# EasyEDA Pro project 多组分NO.2.eprj, schematic Schematic2
Create Date: 2025-03-08; Page Name: P1; Project Name: 多组分NO.2; Schematic Name: Schematic2; Update Date: 2025-04-01; Company: 嘉立创EDA; Page Size: A3; Version: V1.0
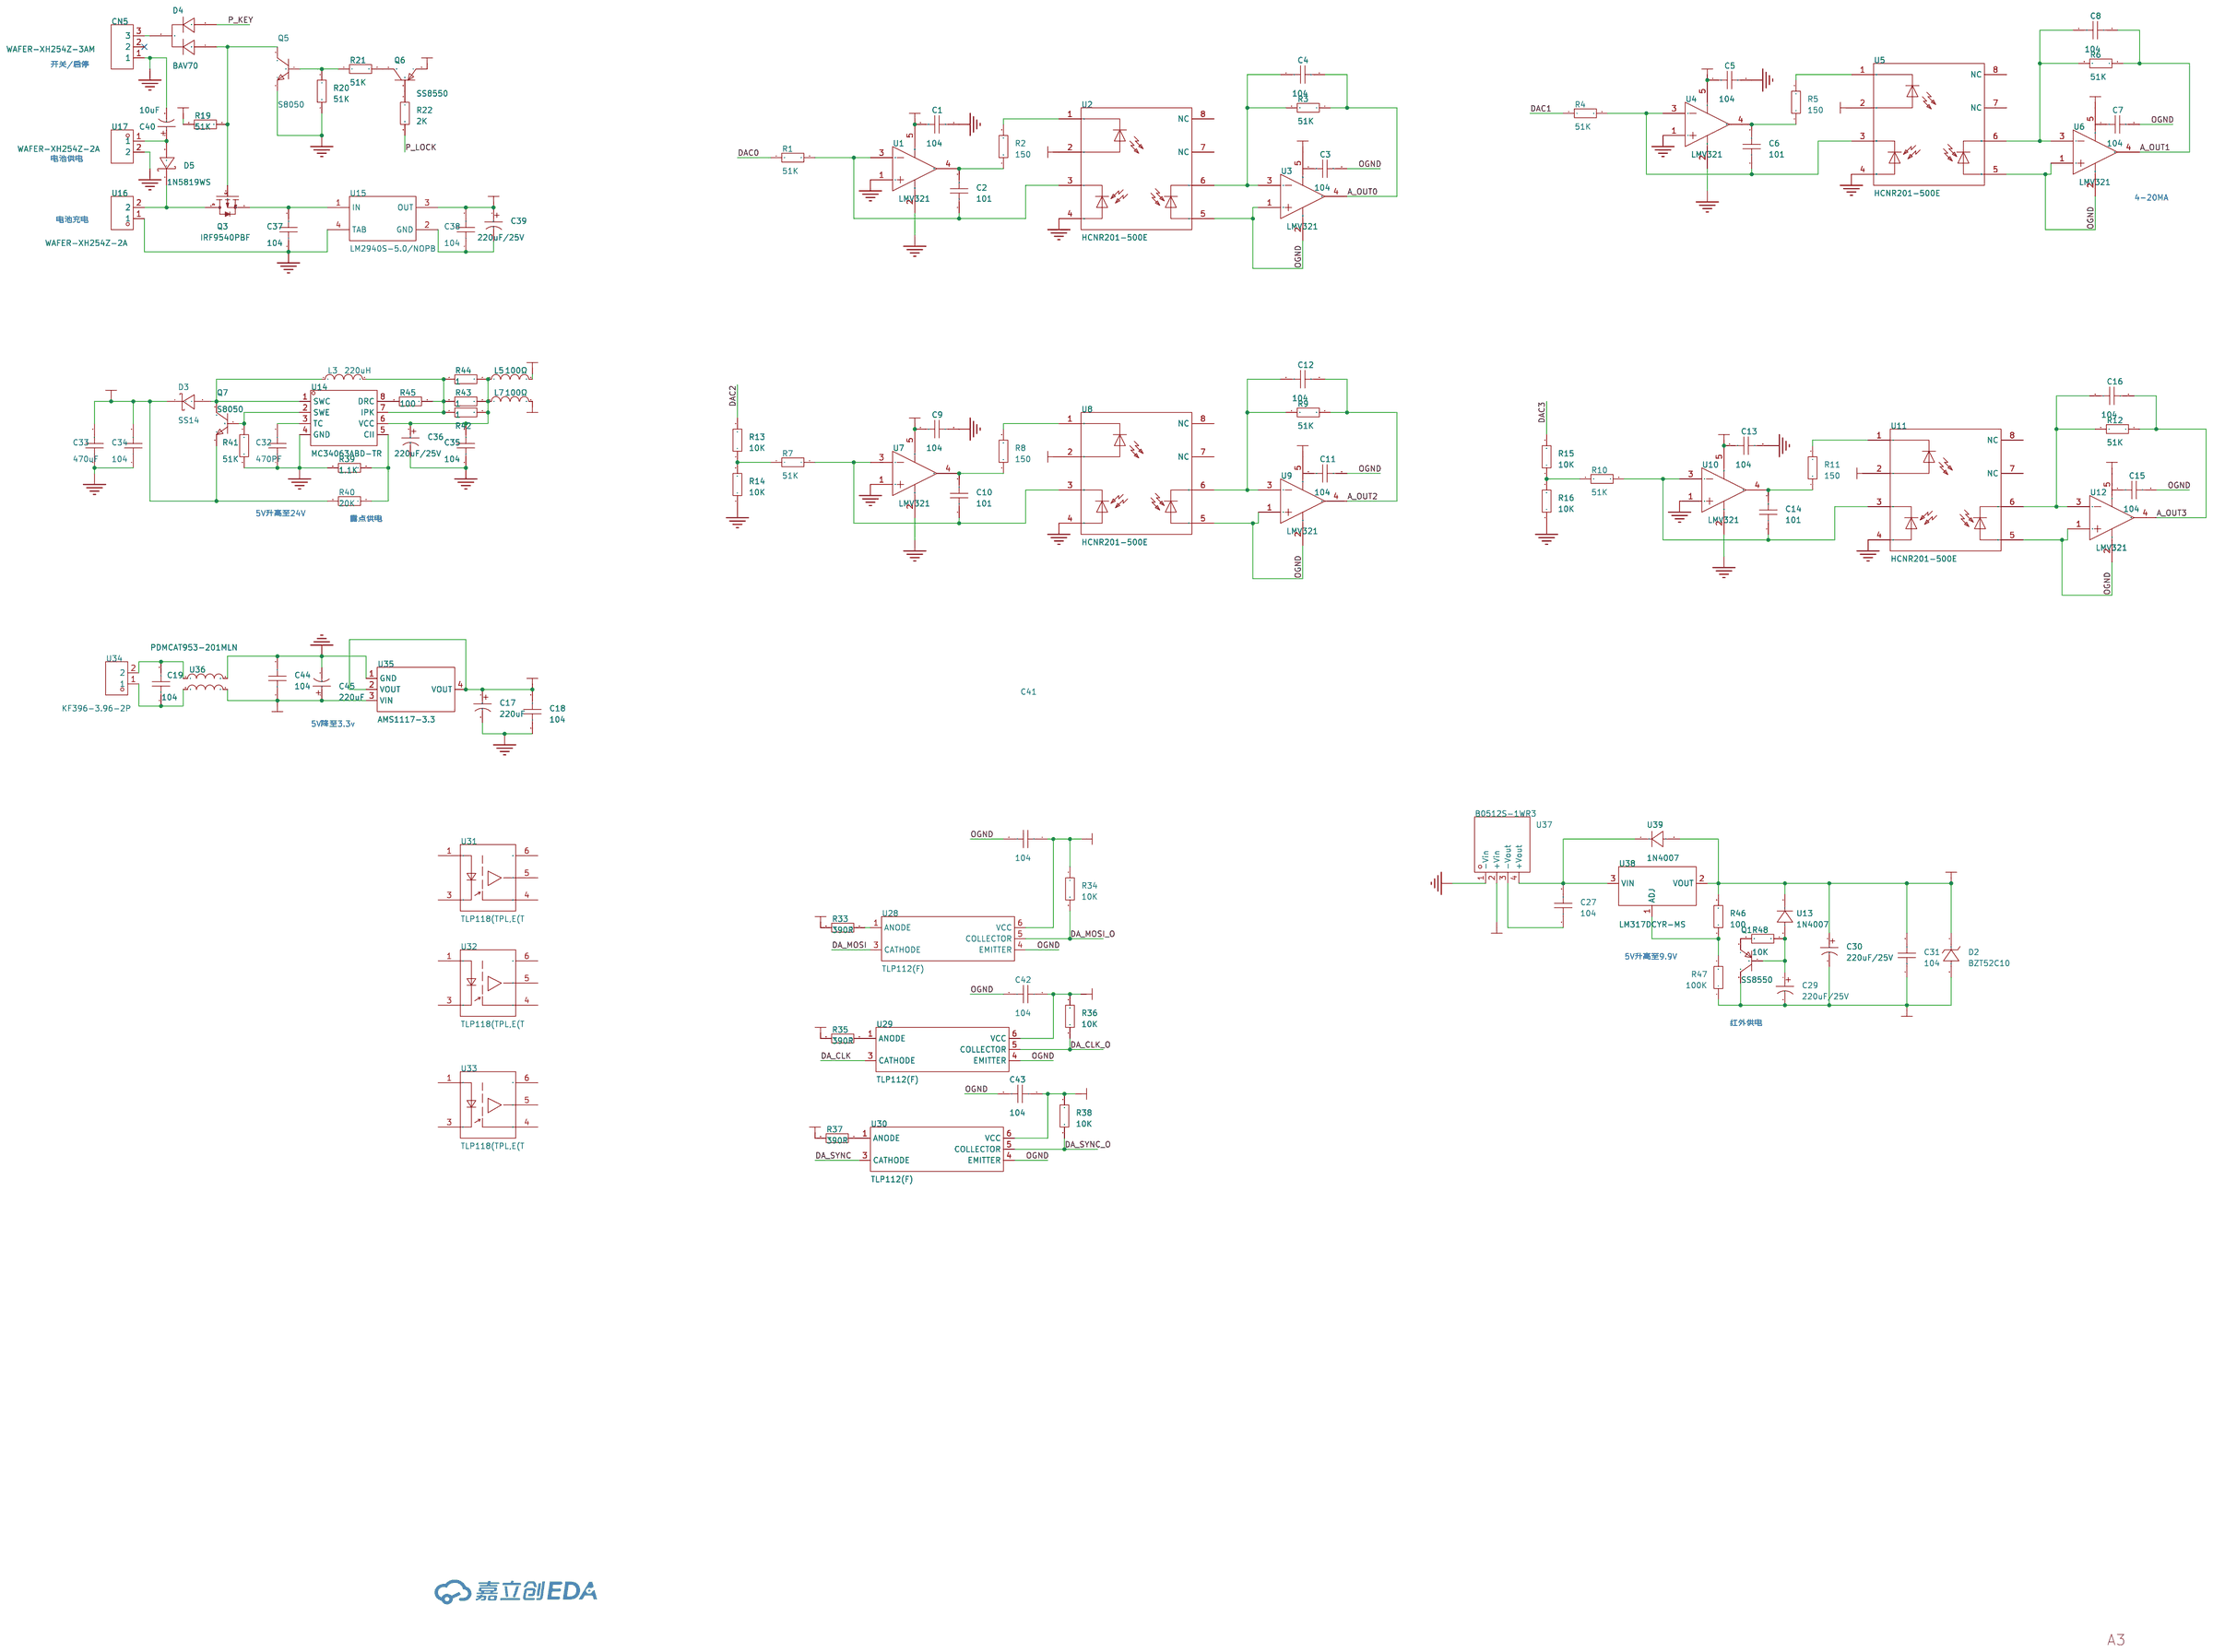
[diagram p4: schematic sheet]

## Parts
C1  104  [C0603]
C2  101  [C0603]
C3  104  [C0603]
C4  104  [C0603]
C5  104  [C0603]
C6  101  [C0603]
C7  104  [C0603]
C8  104  [C0603]
C9  104  [C0603]
C10  101  [C0603]
C11  104  [C0603]
C12  104  [C0603]
C13  104  [C0603]
C14  101  [C0603]
C15  104  [C0603]
C16  104  [C0603]
C17  220uF  [CAP-TH_BD8.0-P3.50-D0.6-FD]
C18  104  [C0603]
C19  104  [C0603]
C27  104  [C0603]
C29  220uF/25V  [CAP-TH_BD6.3-P2.50-D1.0-FD]
C30  220uF/25V  [CAP-TH_BD6.3-P2.50-D1.0-FD]
C31  104  [C0603]
C32  470PF  [C0603]
C33  470uF  [C0603]
C34  104  [C0603]
C35  104  [C0603]
C36  220uF/25V  [CAP-TH_BD6.3-P2.50-D1.0-FD]
C37  104  [C0603]
C38  104  [C0603]
C39  220uF/25V  [CAP-TH_BD6.3-P2.50-D1.0-FD]
C40  10uF  [CAP-TH_BD4.0-P1.50-D0.8-FD]
C41  104  [C0603]
C42  104  [C0603]
C43  104  [C0603]
C44  104  [C0603]
C45  220uF  [CAP-TH_BD8.0-P3.50-D0.6-FD]
CN5  WAFER-XH254Z-3AM  [CONN-TH_3P-P2.50_JS25T-S03XHW-00]
D2  BZT52C10  [SOD-123_L2.7-W1.6-LS3.7-RD-1]
D3  SS14  [SMA_L4.2-W2.6-LS5.3-RD]
D4  BAV70  [SOT-23-3_L3.0-W1.7-P0.95-LS2.9-BR]
D5  1N5819WS  [SOD-323_L1.8-W1.3-LS2.5-RD]
L3  220uH  [IND-SMD_L12.0-W12.0_CDRH127NP]
L5  100Ω  [L0805]
L7  100Ω  [L0805]
Q1  SS8550  [SOT-23-3_L2.9-W1.3-P1.90-LS2.4-BR]
Q3  IRF9540PBF  [TO-220-3_L10.0-W4.5-P2.54-L]
Q5  S8050  [SOT-23-3_L3.0-W1.7-P0.95-LS2.9-BR]
Q6  SS8550  [SOT-23-3_L2.9-W1.3-P1.90-LS2.4-BR]
Q7  S8050  [SOT-23-3_L3.0-W1.7-P0.95-LS2.9-BR]
R1  51K  [R0603]
R2  150  [R0603]
R3  51K  [R0603]
R4  51K  [R0603]
R5  150  [R0603]
R6  51K  [R0603]
R7  51K  [R0603]
R8  150  [R0603]
R9  51K  [R0603]
R10  51K  [R0603]
R11  150  [R0603]
R12  51K  [R0603]
R13  10K  [R0603]
R14  10K  [R0603]
R15  10K  [R0603]
R16  10K  [R0603]
R19  51K  [R0603]
R20  51K  [R0603]
R21  51K  [R0603]
R22  2K  [R0603]
R33  390R  [R0603]
R34  10K  [R0603]
R35  390R  [R0603]
R36  10K  [R0603]
R37  390R  [R0603]
R38  10K  [R0603]
R39  1.1K  [R0603]
R40  20K  [R0603]
R41  51K  [R0603]
R42  1  [R0603]
R43  1  [R0603]
R44  1  [R0603]
R45  100  [R0603]
R46  100  [R0603]
R47  100K  [R0603]
R48  10K  [R0603]
U1  LMV321  [SOT-23-5_L3.0-W1.7-P0.95-LS2.8-BR]
U2  HCNR201-500E  [OPTO-SMD-8P_L11.0-W9.0-P2.54-LS12.4-BL]
U3  LMV321  [SOT-23-5_L3.0-W1.7-P0.95-LS2.8-BR]
U4  LMV321  [SOT-23-5_L3.0-W1.7-P0.95-LS2.8-BR]
U5  HCNR201-500E  [OPTO-SMD-8P_L11.0-W9.0-P2.54-LS12.4-BL]
U6  LMV321  [SOT-23-5_L3.0-W1.7-P0.95-LS2.8-BR]
U7  LMV321  [SOT-23-5_L3.0-W1.7-P0.95-LS2.8-BR]
U8  HCNR201-500E  [OPTO-SMD-8P_L11.0-W9.0-P2.54-LS12.4-BL]
U9  LMV321  [SOT-23-5_L3.0-W1.7-P0.95-LS2.8-BR]
U10  LMV321  [SOT-23-5_L3.0-W1.7-P0.95-LS2.8-BR]
U11  HCNR201-500E  [OPTO-SMD-8P_L11.0-W9.0-P2.54-LS12.4-BL]
U12  LMV321  [SOT-23-5_L3.0-W1.7-P0.95-LS2.8-BR]
U13  1N4007  [SMA_L4.3-W2.6-LS5.1-RD]
U14  MC34063ABD-TR  [SOIC-8_L5.0-W4.0-P1.27-LS6.0-BL]
U15  LM2940S-5.0/NOPB  [TO-263-3_L8.6-W10.2-P2.54-LS14.4-TL]
U16  WAFER-XH254Z-2A  [CONN-TH_2P-P2.50_XH-2A_3045048]
U17  WAFER-XH254Z-2A  [CONN-TH_2P-P2.50_XH-2A_3045048]
U28  TLP112(F)  [SOIC-5_L4.4-W3.6-P1.27-LS7.0-BL]
U29  TLP112(F)  [SOIC-5_L4.4-W3.6-P1.27-LS7.0-BL]
U30  TLP112(F)  [SOIC-5_L4.4-W3.6-P1.27-LS7.0-BL]
U31  TLP118(TPL,E(T  [SOIC-5_L4.6-W3.7-P1.27-LS7.0-BR]
U32  TLP118(TPL,E(T  [SOIC-5_L4.6-W3.7-P1.27-LS7.0-BR]
U33  TLP118(TPL,E(T  [SOIC-5_L4.6-W3.7-P1.27-LS7.0-BR]
U34  KF396-3.96-2P  [CONN-TH_P3.96_KF396-3.96-2P]
U35  AMS1117-3.3  [SOT-223-3_L6.5-W3.4-P2.30-LS7.0-BR]
U36  PDMCAT953-201MLN  [IND-TH_4P-L12..0-W6.0_PDMCAT953-201MLN]
U37  B0512S-1WR3  [PWRM-TH_B0512S-1WR3_C3019592]
U38  LM317DCYR-MS  [SOT-223-3_L6.5-W3.4-P2.30-LS7.0-BR-1]
U39  1N4007  [SMA_L4.3-W2.6-LS5.1-RD]

## Library data of the parts
C1-C16 C18 C19 C27 C31-C35 C37 C38 C41-C44 = CAP_0603: Supplier Footprint: 0603
C17 C45 = 35YXJ220M8X11.5: LCSC Part Name: 220uF ±20% 35V; Supplier Part: C88851; Manufacturer: rubycon(红宝石); Supplier Footprint: 插件,D8xL11.5mm; JLCPCB Part Class: 扩展库; Datasheet: https://atta.szlcsc.com/upload/public/pdf/source/20190927/C432444_D90212164DBC1B856ABE912664018FD4.pdf; Supplier: LCSC; Tolerance: ±20%; Rated Voltage: 35V; Lead Spacing: 3.5mm; φD: 8mm; L: 11.5mm; Lifetime @ Temp: 7000hrs@105℃
C29 C30 C36 C39 = ERS1EM221E11OT: LCSC Part Name: 220uF ±20% 25V; Supplier Part: C141282; Manufacturer: AISHI(艾华集团); Supplier Footprint: 插件,D6.3xL11mm; JLCPCB Part Class: 扩展库; Datasheet: https://atta.szlcsc.com/upload/public/pdf/source/20171106/C141282_15099694444351094052.pdf; Supplier: LCSC; Tolerance: ±20%; Rated Voltage: 25V; Lead Spacing: 2.5mm; φD: 6.3mm; L: 11mm; Lifetime @ Temp: 5000hrs@105℃
C40 = 35ZL10MEFC4X7: LCSC Part Name: 10uF ±20% 35V; Supplier Part: C88808; Manufacturer: rubycon(红宝石); Supplier Footprint: 插件,D4xL7mm; JLCPCB Part Class: 扩展库; Datasheet: https://atta.szlcsc.com/upload/public/pdf/source/20161125/1480067898074.pdf; Supplier: LCSC; Tolerance: ±20%; Rated Voltage: 35V; Lead Spacing: 1.5mm; φD: 4mm; L: 7mm; Lifetime @ Temp: 1000hrs@105℃
CN5 = WAFER-XH254Z-3AM: LCSC Part Name: XH直针3P 耐高温米色; Supplier Part: C22751823; Manufacturer: HANBO(汉博); Supplier Footprint: 插件,P=2.54mm; JLCPCB Part Class: 扩展库; Datasheet: https://atta.szlcsc.com/upload/public/pdf/source/20240628/5F265ED5DCD1AB9F6070F992FAF53820.pdf; Supplier: LCSC
D2 = BZT52C10: Supplier Part: C707140; Manufacturer: Slkor(萨科微); Supplier Footprint: SOD-123; JLCPCB Part Class: 扩展库; Datasheet: https://atta.szlcsc.com/upload/public/pdf/source/20200721/C707125_BAEA70ACC1B0F60BBAC1FD71D8806D24.pdf; Supplier: LCSC; Diode Configuration: 独立式; Zener Voltage (Nom): 10V; Reverse Leakage Current (Ir): 200nA@7V; Zener Voltage (Range): 9.4V~10.6V; Power Dissipation: 500mW; Zener Impedance (Zzt): 20Ω
D3 = SS14_C2480: LCSC Part Name: 电压:40V 电流:1A; Supplier Part: C2480; Manufacturer: MDD(辰达半导体); Supplier Footprint: SMA(DO-214AC); JLCPCB Part Class: 基础库; Datasheet: https://atta.szlcsc.com/upload/public/pdf/source/20240710/EF24798823EE33D63F154ED67BAC5E71.pdf; Supplier: LCSC; Diode Configuration: 独立式; Forward Voltage (Vf@If): 550mV@1A; Reverse Voltage (Vr): 40V; Rectified Current: 1A; Reverse Leakage Current (Ir): 300uA@40V
D4 = BAV70_C68978: Supplier Part: C68978; Manufacturer: CJ(江苏长电/长晶); Supplier Footprint: SOT-23; JLCPCB Part Class: 基础库; Datasheet: https://atta.szlcsc.com/upload/public/pdf/source/20160516/1463363920256.pdf; Supplier: LCSC; Diode Configuration: 1对共阴极; Voltage - Forward(Vf@If): 1.25V@150mA; Voltage - DC Reverse(Vr): 70V; Current - Rectified: 200mA; Reverse Leakage Current (Ir): 2.5uA@70V
D5 = 1N5819WS_C191023: LCSC Part Name: 电压:40V 电流:1A; Supplier Part: C191023; Manufacturer: Hottech(合科泰); Supplier Footprint: SOD-323; JLCPCB Part Class: 基础库; Datasheet: https://atta.szlcsc.com/upload/public/pdf/source/20220428/3CB86FD8D28D653594B4E35F9D5AEFD9.pdf; Supplier: LCSC; Forward Voltage (Vf@If): 600mV@1A; Reverse Voltage (Vr): 40V; Rectified Current: 1A
L3 = SLH1207S221MTT: LCSC Part Name: 220uH ±20%; Supplier Part: C182174; Manufacturer: Sunltech(韩国顺磁); Supplier Footprint: SMD; JLCPCB Part Class: 扩展库; Datasheet: https://atta.szlcsc.com/upload/public/pdf/source/20180509/C216200_948378E1D3CCC25B70CFE5927CB2C576.pdf; Supplier: LCSC; Tolerance: ±20%; Rated Current: 1.16A; DC Resistance (DCR): 390mΩ
L5 L7 = MPZ2012S101AT000: LCSC Part Name: 单路 0805磁珠 阻抗100Ω@100MHz; Supplier Part: C15957; Manufacturer: TDK; Supplier Footprint: 0805; Datasheet: https://atta.szlcsc.com/upload/public/pdf/source/20180727/C15957_77828B3DF5FDC9AFC1601CE2144D889F.pdf; Supplier: LCSC; Impedance @ Frequency: 100Ω@100MHz; Tolerance: ±25%; DC Resistance: 20mΩ; Current Rating: 4A; Circuits: 1
Q1 Q6 = SS8550 Y2(RANGE:200-350): LCSC Part Name: PNP 电流:1.5A 耐压:25V hfe=200~350; Supplier Part: C8542; Manufacturer: CJ(江苏长电/长晶); Supplier Footprint: SOT-23; JLCPCB Part Class: 基础库; Datasheet: https://atta.szlcsc.com/upload/public/pdf/source/20140809/1457707214734.pdf; Supplier: LCSC; Transistor Type: PNP; Collector Current (Ic): 1.5A; Collector-Emitter Breakdown Voltage (Vceo): 25V; Power Dissipation (Pd): 300mW; DC Current Gain (hFE@Ic,Vce): 200@100mA,1V; Transition Frequency (fT): 100MHz; Collector Cut-Off Current (Icbo): 100nA; Collector-Emitter Saturation Voltage (VCE(sat)@Ic,Ib): 500mV@800mA,80mA; Operating Temperature: -55℃~+150℃
Q3 = IRF9540PBF: LCSC Part Name: 1个P沟道 耐压:100V 电流:19A; Supplier Part: C183014; Manufacturer: VISHAY(威世); Supplier Footprint: TO-220AB; JLCPCB Part Class: 扩展库; Datasheet: https://atta.szlcsc.com/upload/public/pdf/source/20180301/C183014_15198945862801384169.pdf; Supplier: LCSC; Type: 1个P沟道; Drain Source Voltage (Vdss): 100V; Continuous Drain Current (Id): 19A; Drain Source On Resistance (RDS(on)@Vgs,Id): 200mΩ@10V,11A; Power Dissipation (Pd): 150W; Gate Threshold Voltage (Vgs(th)@Id): 2V@250uA; Total Gate Charge (Qg@Vgs): 61nC; Input Capacitance (Ciss@Vds): 1.4nF@25V; Reverse Transfer Capacitance (Crss@Vds): 140pF@25V; Operating Temperature: -55℃~+175℃
Q5 Q7 = S8050 J3Y(RANGE:200-350): LCSC Part Name: H档(200-350); Supplier Part: C2146; Manufacturer: CJ(江苏长电/长晶); Supplier Footprint: SOT-23; JLCPCB Part Class: 基础库; Datasheet: https://atta.szlcsc.com/upload/public/pdf/source/20231013/FF37B6A000E6CDA75C9C999D2E78731F.pdf; Supplier: LCSC; type: NPN; Current - Collector(Ic): 500mA; Collector - Emitter Voltage VCEO: 25V; Pd - Power Dissipation: 300mW; DC Current Gain: 200@500mA,1V; Transition frequency(fT): 150MHz; Current - Collector Cutoff: 100nA; Vce Saturation(VCE(sat)): 600mV; Operating Temperature: -55℃~+150℃
R1-R16 R19-R22 R33-R48 = Res_0603: Supplier Footprint: 0603
U1 U3 U4 U6 U7 U9 U10 U12 = LMV321: Supplier Part: C2904381; Manufacturer: Slkor(萨科微); Supplier Footprint: SOT-23-5; JLCPCB Part Class: 扩展库; Datasheet: https://atta.szlcsc.com/upload/public/pdf/source/20211008/F7FE51BBE778A8191EAE612DAA5D60E0.pdf; Supplier: LCSC; Number of Channels: 单路; Maximum Power Supply Range (Vdd-Vss): 5.5V; Gain Bandwidth Product: 1MHz; Vos - Input Offset Voltage: 9mV; Slew Rate: 400V/ms; Noise density(eN): 40nV/√Hz@1kHz; Common Mode Rejection Ratio(CMRR): 85dB; Operating Temperature: -40℃~+85℃
U2 U5 U8 U11 = HCNR201-500E: Supplier Part: C27465; Manufacturer: Broadcom/AVAGO(安华高); Supplier Footprint: SOP-8-2.54mm; JLCPCB Part Class: 扩展库; Datasheet: https://atta.szlcsc.com/upload/public/pdf/source/20140314/1457707017389.pdf; Supplier: LCSC; Forward Voltage: 1.6V；1.6V；1.6V; Isolation Voltage(rms): 5kV；5kV；5kV; Number of Outputs: 1；1；1; Operating Temperature: -55℃~+100℃；-55℃~+100℃；-55℃~+100℃
U13 U39 = 1N4007: Supplier Part: C9900004759; JLCPCB Part Class: 扩展库; Supplier: LCSC
U14 = MC34063ABD-TR: Supplier Part: C81155; Manufacturer: ST(意法半导体); Supplier Footprint: SOIC-8; JLCPCB Part Class: 扩展库; Datasheet: https://atta.szlcsc.com/upload/public/pdf/source/20181022/C283638_2164B0C2D1BFA8C32AE6890732A893F8.pdf; Supplier: LCSC; Function: 升压型；降压型; Output Type: 可调; Input Voltage: 3V~40V; Output Voltage: 1.25V~38V; Output Current (Max): 1.5A; Switching Frequency: 33kHz; Operating Temperature: -40℃~+85℃@(TA); Synchronous Rectification: 否; Number of Outputs: 1; Topology: 升压式；降压式; Switch tube (built-in/external): 内置
U15 = LM2940S-5.0/NOPB: LCSC Part Name: 1A、26V、高 PSRR、低压降稳压器; Supplier Part: C133956; Manufacturer: TI(德州仪器); Supplier Footprint: TO-263-3; JLCPCB Part Class: 扩展库; Datasheet: https://www.ti.com/cn/lit/gpn/lm2940c; Supplier: LCSC; Output Type: 固定; Maximum Input Voltage: 26V; Output Voltage: 5V; Output Current: 1A; Power Supply Rejection Ratio (PSRR): 64dB@(120Hz); Dropout Voltage: 1V@(1A); standby current: 10mA; Feature: 防静电保护；欠压闭锁；热保护(TSD)；过压保护(OVP)；过流保护(OCP)；短路保护; Operating Temperature: -40℃~+125℃; Output Polarity: 正极; Number of Outputs: 1
U16 U17 = WAFER-XH254Z-2A: Supplier Part: C7432682; Manufacturer: HANBO(汉博); Supplier Footprint: 插件,P=2.5mm; JLCPCB Part Class: 扩展库; Datasheet: https://atta.szlcsc.com/upload/public/pdf/source/20230718/3B4FABA5D38EFB02DAF74E7C2B33D98F.pdf; Supplier: LCSC; Pins Structure: 1x2P; Pitch: 2.54mm; Mounting Style: 直插; Reference Series: XH; Number of Pins: 2P; Number of Rows: 1; Number of PINs Per Row: 2; Current Rating (Max): 3A; Operating Temperature Range: -25℃~+85℃
U28-U30 = TLP112(F): Supplier Part: C5331587; Manufacturer: TOSHIBA(东芝); Supplier Footprint: SOP-5; JLCPCB Part Class: 扩展库; Datasheet: https://atta.szlcsc.com/upload/public/pdf/source/20221215/FA221715623C1DFDFF8354E0697E69BF.pdf; Supplier: LCSC
U31-U33 = TLP118(TPL,E(T: Supplier Part: C5143731; Manufacturer: TOSHIBA(东芝); Supplier Footprint: SOP-5; Datasheet: https://atta.szlcsc.com/upload/public/pdf/source/20230614/12B34A190602916E54130EA1B1A44D3C.pdf; Supplier: LCSC
U34 = KF396-3.96-2P: LCSC Part Name: 3.96mm 1x2P 排数:1 每排P数:2 直插; Supplier Part: C474894; Manufacturer: KEFA(科发); Supplier Footprint: 插件,P=3.96mm; JLCPCB Part Class: 扩展库; Datasheet: https://atta.szlcsc.com/upload/public/pdf/source/20230317/D705CA61FD1083088BFCE8201269EBDF.pdf; Supplier: LCSC; Structure: 1x2P; Pitch: 3.96mm; Color: 绿色; Mounting Style: 直插; Current Rating (Max): 10A; Voltage Rating (Max): 300V; Number of Pins: 2P; Number of Rows: 1; Wire Gauge - AWG: 18~24; Wire Gauge - mm2: 0.75; Number of PINs Per Row: 2; Operating Temperature Range: -40℃~+105℃
U35 = AMS1117-3.3_C6186: LCSC Part Name: 输出3.3V 1A; Supplier Part: C6186; Manufacturer: AMS; Supplier Footprint: SOT-223; JLCPCB Part Class: 基础库; Datasheet: https://atta.szlcsc.com/upload/public/pdf/source/20180727/C6186_7A095716F0823C02F1997A905E26C086.pdf; Supplier: LCSC; Output Type: 固定; Output Voltage: 3.3V; Output Current: 1A; Power Supply Rejection Ratio (PSRR): 72dB@(120Hz); Voltage Dropout: 1.3V@(800mA); Features: 过流保护(OCP)；热关断(TSD); Output Configuration: 正极; Number of Outputs: 1
U36 = PDMCAT953-201MLN: LCSC Part Name: 共模电感200uH 3A 12mΩMAX 953环 过EMC; Supplier Part: C5158065; Manufacturer: PROD(谱罗德); Supplier Footprint: 插件; JLCPCB Part Class: 扩展库; Datasheet: https://atta.szlcsc.com/upload/public/pdf/source/20220920/A5F89F02D75603786B8CAE67DCC5F966.pdf; Supplier: LCSC; Number of Lines: 2; Current Rating: 3A; Inductance @ Frequency: 200uH@1kHz; DC Resistance(DCR): 12mΩ
U37 = B0512S-1WR3_C7465188: LCSC Part Name: DC-DC输入5V输出12V 84mA 1W输出短路保护; Supplier Part: C7465188; Manufacturer: EVISUN(易成); Supplier Footprint: SIP-4; JLCPCB Part Class: 扩展库; Datasheet: https://atta.szlcsc.com/upload/public/pdf/source/20230718/BF3EB05DF14EA4A594DA80D4BE82711A.pdf; Supplier: LCSC; Power: 1W; input voltage (Vdc): 4.5V~5.5V; Conversion Efficiency: 83%; Output Voltage: 12V; Output Current (Max): 84mA; Maximum Capacitive Load: 560uF; Insulated Voltage: 1.5kV; Protective function: 短路保护
U38 = LM317DCYR-MS: Supplier Part: C7473164; Manufacturer: MSKSEMI(美森科); Supplier Footprint: SOT-223; JLCPCB Part Class: 扩展库; Datasheet: https://atta.szlcsc.com/upload/public/pdf/source/20231130/1AD4ED482F53116ADA3427DAD2350B06.pdf; Supplier: LCSC; Output Type: 固定; Maximum Input Voltage: 40V; Output Voltage: 1.2V~37V; Output Current: 1.5A; Power Supply Rejection Ratio (PSRR): 75dB@(120Hz); Feature: 短路保护；热保护(TSD)；过流保护(OCP); Output Polarity: 正极

## Nets
0V: C29.2 C30.2 C31.1 D2.2(A) Q1.3(C) R47.1
3.3V: C17.1 C18.2 U35.2(VOUT) U35.4(VOUT)
5V: C38.2 C39.1 C44.1 C45.1 L5.2 Q6.2(E) R33.2 R35.2 R37.2 U15.3(OUT) U35.3(VIN) U36.4 U37.2(+Vin)
9.9V: C30.1 C31.2 D2.1(C) R46.2 U13.1(K) U38.2(VOUT) U39.2(A)
+24V: C33.2 C34.2 D3.1(K) Q7.2(E) R40.2
AVDD: C1.1 C5.1 C9.1 C13.1 U1.5(VCC+) U2.2(L AN) U4.5(VCC+) U5.2(L AN) U7.5(VCC+) U8.2(L AN) U10.5(VCC+) U11.2(L AN)
GND: C1.2 C5.2 C9.2 C13.2 C17.2 C18.1 C32.1 C33.1 C34.1 C35.1 C36.2 C37.1 C40.2 C44.2 C45.2 CN5.1 Q5.2(E) R14.1 R16.1 R20.2 R39.2 R41.2 U1.1(IN+) U1.2(GND) U2.4(PD1 AN) U4.1(IN+) U4.2(GND) U5.4(PD1 AN) U7.1(IN+) U7.2(GND) U8.4(PD1 AN) U10.1(IN+) U10.2(GND) U11.4(PD1 AN) U14.4(GND) U15.4(TAB) U16.1 U17.2 U35.1(GND) U36.2 U37.1(-Vin)
VBAT: R19.2
VIN: L7.2
A_OUT0: C4.2 R3.1 U3.4(OUT)
A_OUT1: C8.2 R6.1 U6.4(OUT)
A_OUT2: C12.2 R9.1 U9.4(OUT)
A_OUT3: C16.2 R12.1 U12.4(OUT)
DA_CLK: U29.3(CATHODE)
DA_CLK_O: R36.2 U29.5(COLLECTOR)
DA_MOSI: U28.3(CATHODE)
DA_MOSI_O: R34.2 U28.5(COLLECTOR)
DA_SYNC: U30.3(CATHODE)
DA_SYNC_O: R38.2 U30.5(COLLECTOR)
DAC0: R1.1
DAC1: R4.1
DAC2: R13.2
DAC3: R15.2
OGND: C3.2 C7.2 C11.2 C15.2 C41.2 C42.2 C43.2 U2.5(PD2 AN) U3.1(IN+) U3.2(GND) U5.5(PD2 AN) U6.1(IN+) U6.2(GND) U8.5(PD2 AN) U9.1(IN+) U9.2(GND) U11.5(PD2 AN) U12.1(IN+) U12.2(GND) U28.4(EMITTER) U29.4(EMITTER) U30.4(EMITTER)
OVDD: C41.1 C42.1 C43.1 R34.1 R36.1 R38.1 U3.5(VCC+) U6.5(VCC+) U9.5(VCC+) U12.5(VCC+) U28.6(VCC) U29.6(VCC) U30.6(VCC)
P_KEY: D4.2
P_LOCK: R22.2
Net-(C2-1): C2.1 R1.2 U1.3(IN-) U2.3(PD1 CAT)
Net-(C2-2): C2.2 R2.1 U1.4(OUT)
Net-(C4-1): C4.1 R3.2 U2.6(PD2 CAT) U3.3(IN-)
Net-(C6-1): C6.1 R4.2 U4.3(IN-) U5.3(PD1 CAT)
Net-(C6-2): C6.2 R5.1 U4.4(OUT)
Net-(C8-1): C8.1 R6.2 U5.6(PD2 CAT) U6.3(IN-)
Net-(C10-1): C10.1 R7.2 U7.3(IN-) U8.3(PD1 CAT)
Net-(C10-2): C10.2 R8.1 U7.4(OUT)
Net-(C12-1): C12.1 R9.2 U8.6(PD2 CAT) U9.3(IN-)
Net-(C14-1): C14.1 R10.2 U10.3(IN-) U11.3(PD1 CAT)
Net-(C14-2): C14.2 R11.1 U10.4(OUT)
Net-(C16-1): C16.1 R12.2 U11.6(PD2 CAT) U12.3(IN-)
Net-(C19-1): C19.1 U34.1 U36.3
Net-(C19-2): C19.2 U34.2 U36.1
Net-(C27-1): C27.1 U37.3(-Vout)
Net-(C27-2): C27.2 U37.4(+Vout) U38.3(VIN) U39.1(K)
Net-(C29-1): C29.1 Q1.1(B) R48.1 U13.2(A)
Net-(C32-2): C32.2 U14.3(TC)
Net-(C35-2): C35.2 C36.1 L5.1 L7.1 R42.1 R43.1 R44.1 U14.6(VCC)
Net-(C37-2): C37.2 Q3.3(S) U15.1(IN)
Net-(C38-1): C38.1 C39.2 U15.2(GND)
Net-(C40-1): C40.1 D5.2(A) U17.1
Net-(CN5-3): CN5.3 D4.3
Net-(D3-2): D3.2(A) L3.1 Q7.3(C) U14.1(SWC)
Net-(D4-1): D4.1 Q3.1(G) Q5.3(C) R19.1
Net-(D5-1): D5.1(K) Q3.2(D) U16.2
Net-(L3-2): L3.2 R42.2 R43.2 R44.2 R45.1 U14.7(IPK)
Net-(Q1-2): Q1.2(E) R48.2
Net-(Q5-1): Q5.1(B) R20.1 R21.1
Net-(Q6-1): Q6.1(B) R22.1
Net-(Q6-3): Q6.3(C) R21.2
Net-(Q7-1): Q7.1(B) R41.1 U14.2(SWE)
Net-(R2-2): R2.2 U2.1(L CAT)
Net-(R5-2): R5.2 U5.1(L CAT)
Net-(R7-1): R7.1 R13.1 R14.2
Net-(R8-2): R8.2 U8.1(L CAT)
Net-(R10-1): R10.1 R15.1 R16.2
Net-(R11-2): R11.2 U11.1(L CAT)
Net-(R33-1): R33.1 U28.1(ANODE)
Net-(R35-1): R35.1 U29.1(ANODE)
Net-(R37-1): R37.1 U30.1(ANODE)
Net-(R39-1): R39.1 R40.1 U14.5(CII)
Net-(R45-2): R45.2 U14.8(DRC)
Net-(R46-1): R46.1 R47.2 U38.1(ADJ)

Not connected (* = marked no-connect by the designer): C3 1; C7 1; C11 1; C15 1; CN5 2*; U2 7(NC) 8(NC); U5 7(NC) 8(NC); U8 7(NC) 8(NC); U11 7(NC) 8(NC); U31 1(AN) 3(CAT) 4(GND) 5(VO) 6(VCC); U32 1(AN) 3(CAT) 4(GND) 5(VO) 6(VCC); U33 1(AN) 3(CAT) 4(GND) 5(VO) 6(VCC)

## Notes on the sheet
- 开关/启停
- 电池供电
- 4-20MA
- 电池充电
- 5V升高至24V
- 露点供电
- 5V降至3.3v
- 5V升高至9.9V
- 红外供电
